# Altium schematic sheet Lamp_Driver.SchDoc: Lamp driver
size B; Date: 13/02/2022; Author: Szymon Kedzierski; DrawnBy: Szymon Kedzierski; Engineer: Szymon Kedzierski; SheetNumber: 1; SheetTotal: 1
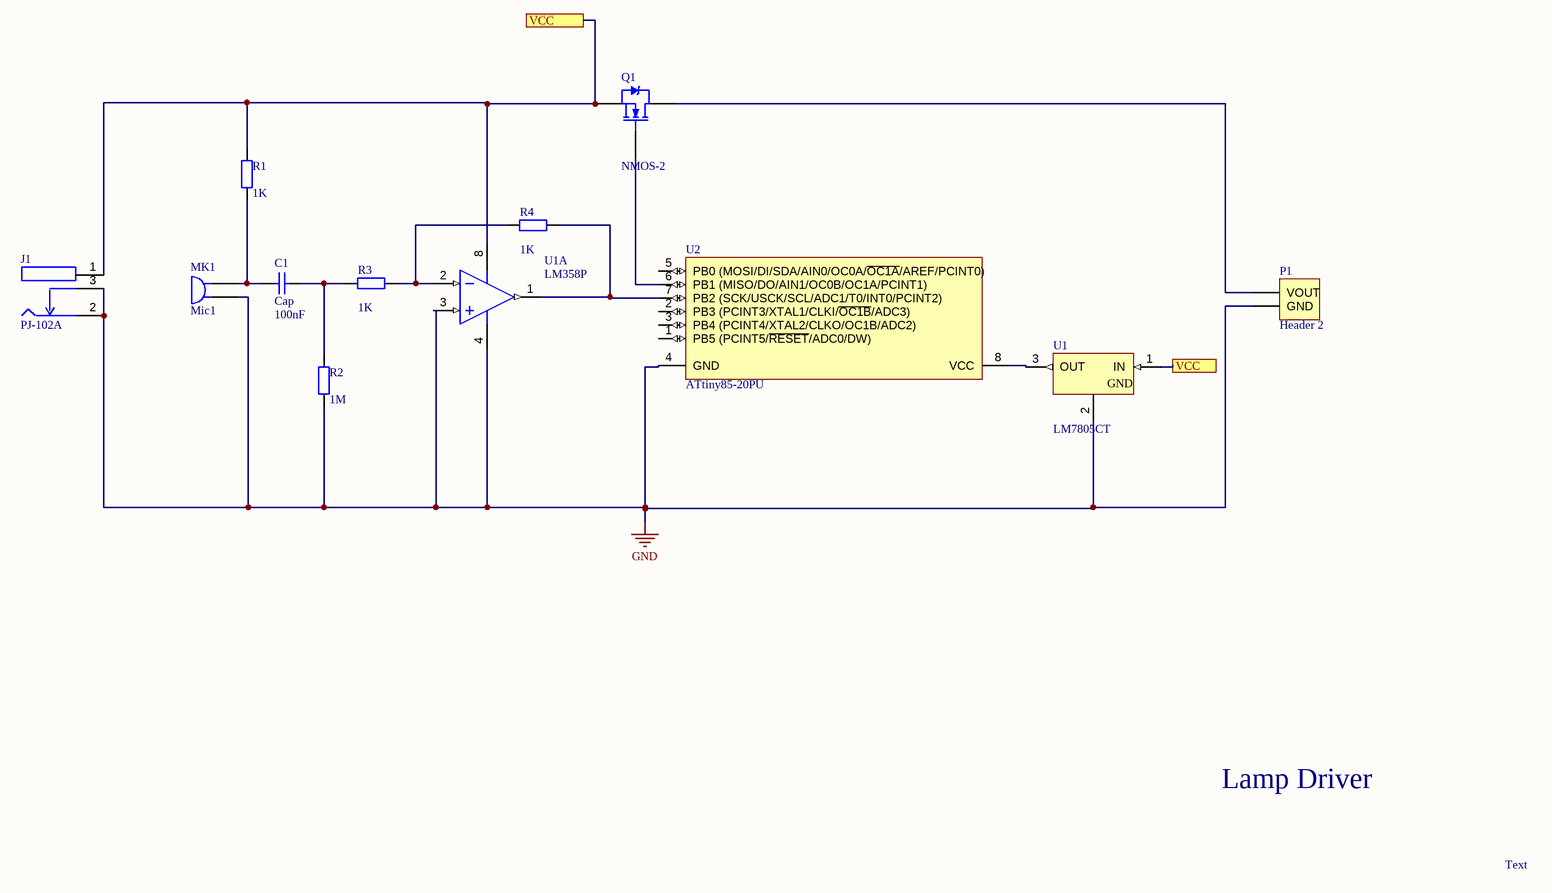
[diagram p0: Lamp_Driver.SchDoc]

## Parts
(Parts that share a designator on the sheet are numbered #1, #2 ... from top to bottom, then left to right.)
C1  Cap  value 100nF  [RAD-0.3]
J1  PJ-102A  [FP-PJ-102A-MFG]
MK1  Mic1  [PIN2]
P1  Header 2  [HDR1X2]
Q1  NMOS-2  [TO-220AB]
R1  value 1K  [AXIAL-0.4]  (hidden comment: Res2)
R2  value 1M  [AXIAL-0.4]  (hidden comment: R)
R3  value 1K  [AXIAL-0.4]  (hidden comment: Res2)
R4  value 1K  [AXIAL-0.4]  (hidden comment: Res2)
U1#1  LM358P  [P0008A]  (part A of 2)
U1#2  LM7805CT  [FAIR-TO-220-3]
U2  ATtiny85-20PU  [8P3]

## Ports
VCC

## Nets
GND: J1.2 J1.3 MK1.1 P1.2(GND) R2.1 U1#1.3(1IN+) U1#1.4(GND) U1#2.2(GND) U2.4(GND)
VCC: J1.1 Q1.3(S) R1.2 U1#1.8(VCC) U1#2.1(IN) ; port VCC
NetC1_1: C1.1 MK1.2 R1.1
NetC1_2: C1.2 R2.2 R3.1
NetP1_1: P1.1(VOUT) Q1.2(D)
NetQ1_1: Q1.1(G) U2.6(PB1_(MISO/DO/AIN1/OC0B/OC1A/PCINT1))
NetR3_2: R3.2 R4.1 U1#1.2(1IN-)
NetR4_2: R4.2 U1#1.1(1OUT) U2.7(PB2_(SCK/USCK/SCL/ADC1/T0/INT0/PCINT2))
NetU1#2_3: U1#2.3(OUT) U2.8(VCC)

Not connected (* = marked no-connect by the designer): U2 1(PB5_(PCINT5/~{RESET}/ADC0/DW)) 2(PB3_(PCINT3/XTAL1/CLKI/~{OC1B}/ADC3)) 3(PB4_(PCINT4/XTAL2/CLKO/OC1B/ADC2)) 5(PB0_(MOSI/DI/SDA/AIN0/OC0A/~{OC1A}/AREF/PCINT0))

## Notes on the sheet
- Lamp Driver
- Text
- DWG. NO.
- REV.
- SHT.
- THIS DOCUMENT AND THE DATA DISCLOSED HEREIN OR HEREWITH IS THE PROPERTY OF ALTIUM LIMITED AND MAY BE FREELY DISTRIBUTED IN WHOLE. NO RIGHTS ARE RESERVED OR EXPRESS OR IMPLIED WARANTEE GIVEN.
- REVISION
- DESCRIPTION
- DATE
- APPROVED
- ENG:
- APPROVALS
- PROJECT
- DSN:
- CHK:
- REFERENCE DOCUMENTS
- PROJECT REVISION:
- TITLE
- DOCUMENT REVISION:
- DESIGN ITEM:
- BOM:
- FAB DWG:
- PCB DWG:
- ASSY DWG:
- SCALE:
- SIZE
- B
- CAGE CODE
- FILE NAME
- DWG NO.
- SHEET
- OF
- REV

## Library data of the parts
C1 = Cap: Capacitor; Published: 8-Jun-2000; LatestRevisionDate: 17-Jul-2002; LatestRevisionNote: Re-released for DXP Platform.; PackageReference: RAD-0.3; Publisher: Altium Limited; PackageDescription: Radial Cap, Thru-Hole; 2 Leads; 0.3 in Pin Spacing
J1 = CMP-2000-06899-2: CONN PWR JACK 2X5.5MM SOLDER; Manufacturer: CUI; Conn Gender: Male; Voltage: 24V; Industry Recognized Mating Diameter: 2.10mm ID (0.083"), 5.50mm OD (0.217"); Number Of Contacts: 3; Number of Positions/Contacts: 2 Conductors, 3 Contacts; Current Rating: 2.5A; Conn Orientation: Right Angle; ComponentLink2URL: http://www.cui.com/product/resource/pj-102a.pdf; Manufacturer Part Number: PJ-102A; Contact Material: Tin,Nickel; Digikey Description: CONN PWR JACK 2X5.5MM SOLDER; RoHS: TRUE; Height: 11.2mm; Category: Conn; Octopart: https://octopart.com/pj-102a-cui-286936; Device Class L1: Connectors; Automotive: No; Package: PJ-102A; Device Class L2: Power Connectors; Temperature Range Low: -25°C; Temperature: -25°C to +85°C; Mouser Description: DC Power Connectors Power Jacks; Lead Free: Yes; Device Class L3: unset; Voltage Rating: 24V; ComponentLink2Description: Datasheet; Temperature Range High: +85°C
MK1 = Mic1: Microphone; Published: 24-Mar-1999; LatestRevisionDate: 17-Jul-2002; LatestRevisionNote: Re-released for DXP Platform.; PackageReference: PIN2; Publisher: Altium Limited
P1 = Header 2: Header, 2-Pin; LatestRevisionDate: 17-Jul-2002; LatestRevisionNote: Re-released for DXP Platform.; Publisher: Altium Limited
Q1 = NMOS-2: N-Channel Power MOSFET; Note: Pin 2 is electrically connected to pin 4.; Published: 8-Jun-2000; LatestRevisionDate: 17-Jul-2002; LatestRevisionNote: Re-released for DXP Platform.; DatasheetVersion: PD-9.814; PackageVersion: Feb-1997; PackageReference: TO-220AB; Publisher: Altium Limited; PackageDescription: TO, Thru-Hole, Vertical, Heatsink Mounted; 3 In-Line Leads; Pitch 2.54 mm; ComponentLink1Description: Manufacturer Link; ComponentLink1URL: http://www.irf.com/
R1-R4 = Res2: Resistor; Published: 8-Jun-2000; LatestRevisionDate: 17-Jul-2002; LatestRevisionNote: Re-released for DXP Platform.; PackageReference: AXIAL-0.4; Publisher: Altium Limited; PackageDescription: Axial Device, Thru-Hole; 2 Leads; 0.4 in Pin Spacing
U1#1 = CMP-2000-06549-1: Dual Operational Amplifier, 3 to 32 V, 0 to 70 degC, 8-Pin PDIP (P), RoHS, Tape and Reel; Manufacturer: Technik Industrial; Datasheet Version: Rev. T, 04/2015; Datasheet URL: http://www.ti.com/lit/ds/symlink/lm358.pdf; Manufacturer URL: http://www.technik.com.hk/; Package Description: 8-Pin Double In-line Package, Body 9.59 x 6.35 mm, Pitch 2.54 mm; Mounting Technology: ThroughHole; Package URL: http://www.ti.com/lit/ml/mpdi001b/mpdi001b.pdf; Package Reference: P8
U1#2 = CMP-2000-04938-1: Positive Voltage Regulator, 5 V, 1 A, -40 to 125 degC, 3-Pin TO-220, RoHS, Tube; Manufacturer: FairchildSemiconductor; Maximum Input Voltage: 35V; Maximum Quiescent Current: 8mA; Load Regulation: 100mV; Maximum Output Current: 2.2(Typ)A; Output Type: Fixed; Typical Dropout Voltage @ Current: 2@1AV; Rad Hard: No; Output Voltage: 5V; Accuracy: ±4%; Number of Outputs: 1; Category: LinearRegulator; Package Description: 3-Pin Through Hole Device, Body 10 x 4.5 mm, Pitch 2.54 mm; Packaging: Rail/Tube; Mounting: ThroughHole; Polarity: Positive; Manufacturer URL: https://www.fairchildsemi.com/; Line Regulation: 100mV; Datasheet Version: Aug-12; Datasheet URL: https://datasheet.ciiva.com/26904/lm7805ct-26904988.pdf; Package Reference: TO-220; Package URL: https://www.fairchildsemi.com/package-drawings/TO/TO220B03.pdf; Package: 3TO-220AB; Operating Temperature: -40to125degC; Type: Linear
U2 = CMP-0093-00032-2: 8-bit AVR Microcontroller, 20MHz, 2.7-5.5V, 8K Flash, 512 Bytes EEPROM, 512 Bytes SRAM, Industrial Grade (-40°C to 85°C), 8-Lead PDIP, Pb-Free; PackageVersion: revB, Jan-2002; ComponentLink2URL: http://www.atmel.com/dyn/resources/prod_documents/doc2586.pdf; PackageReference: 8P3; ComponentLink2Description: ATtiny25/45/85 Datasheet; ComponentLink3Description: ATtiny25/45/85 Summary; ComponentLink3URL: http://www.atmel.com/dyn/resources/prod_documents/2586S.pdf; RevisionNote: DatasheetVersion updated. URLs added.; DatasheetVersion: revN, Apr-2011; ComponentLink1Description: Manufacturer URL; Code_JEDEC: MS-001-BA; ComponentLink1URL: http://www.atmel.com/; PackageDescription: 8-Lead, 0.300" Wide Body, Plastic Dual In-Line Package (PDIP)